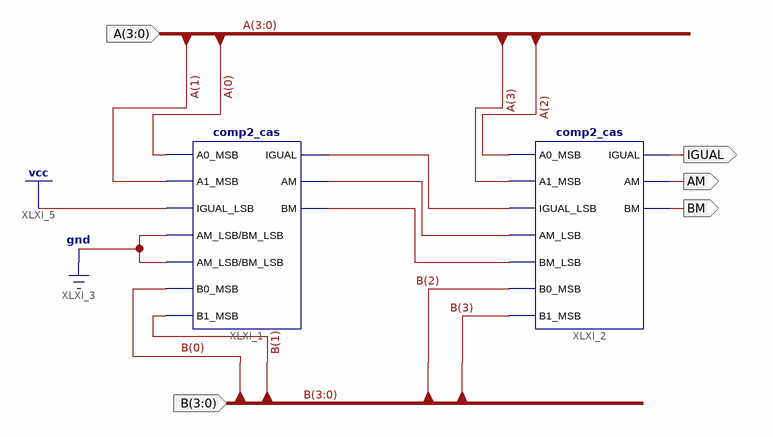
[diagram p0: schematic sheet 1]
// Xilinx ISE schematic comp4_cas.sch (spartan3e) as structural Verilog: 2 symbols, 5 ports
module comp4_cas (
  input  [3:0] A,
  input  [3:0] B,
  output IGUAL,
  output AM,
  output BM
);

  wire XLXN_16, XLXN_17, XLXN_18;

  comp2_cas XLXI_1 (
    .A0_MSB(A[0]), .A1_MSB(A[1]), .AM(XLXN_17), .AM_LSB(1'b0), .B0_MSB(B[0]), .B1_MSB(B[1]), .BM(XLXN_16),
    .BM_LSB(1'b0), .IGUAL(XLXN_18), .IGUAL_LSB(1'b1));
  comp2_cas XLXI_2 (
    .A0_MSB(A[2]), .A1_MSB(A[3]), .AM(AM), .AM_LSB(XLXN_17), .B0_MSB(B[2]), .B1_MSB(B[3]), .BM(BM),
    .BM_LSB(XLXN_16), .IGUAL(IGUAL), .IGUAL_LSB(XLXN_18));
endmodule
